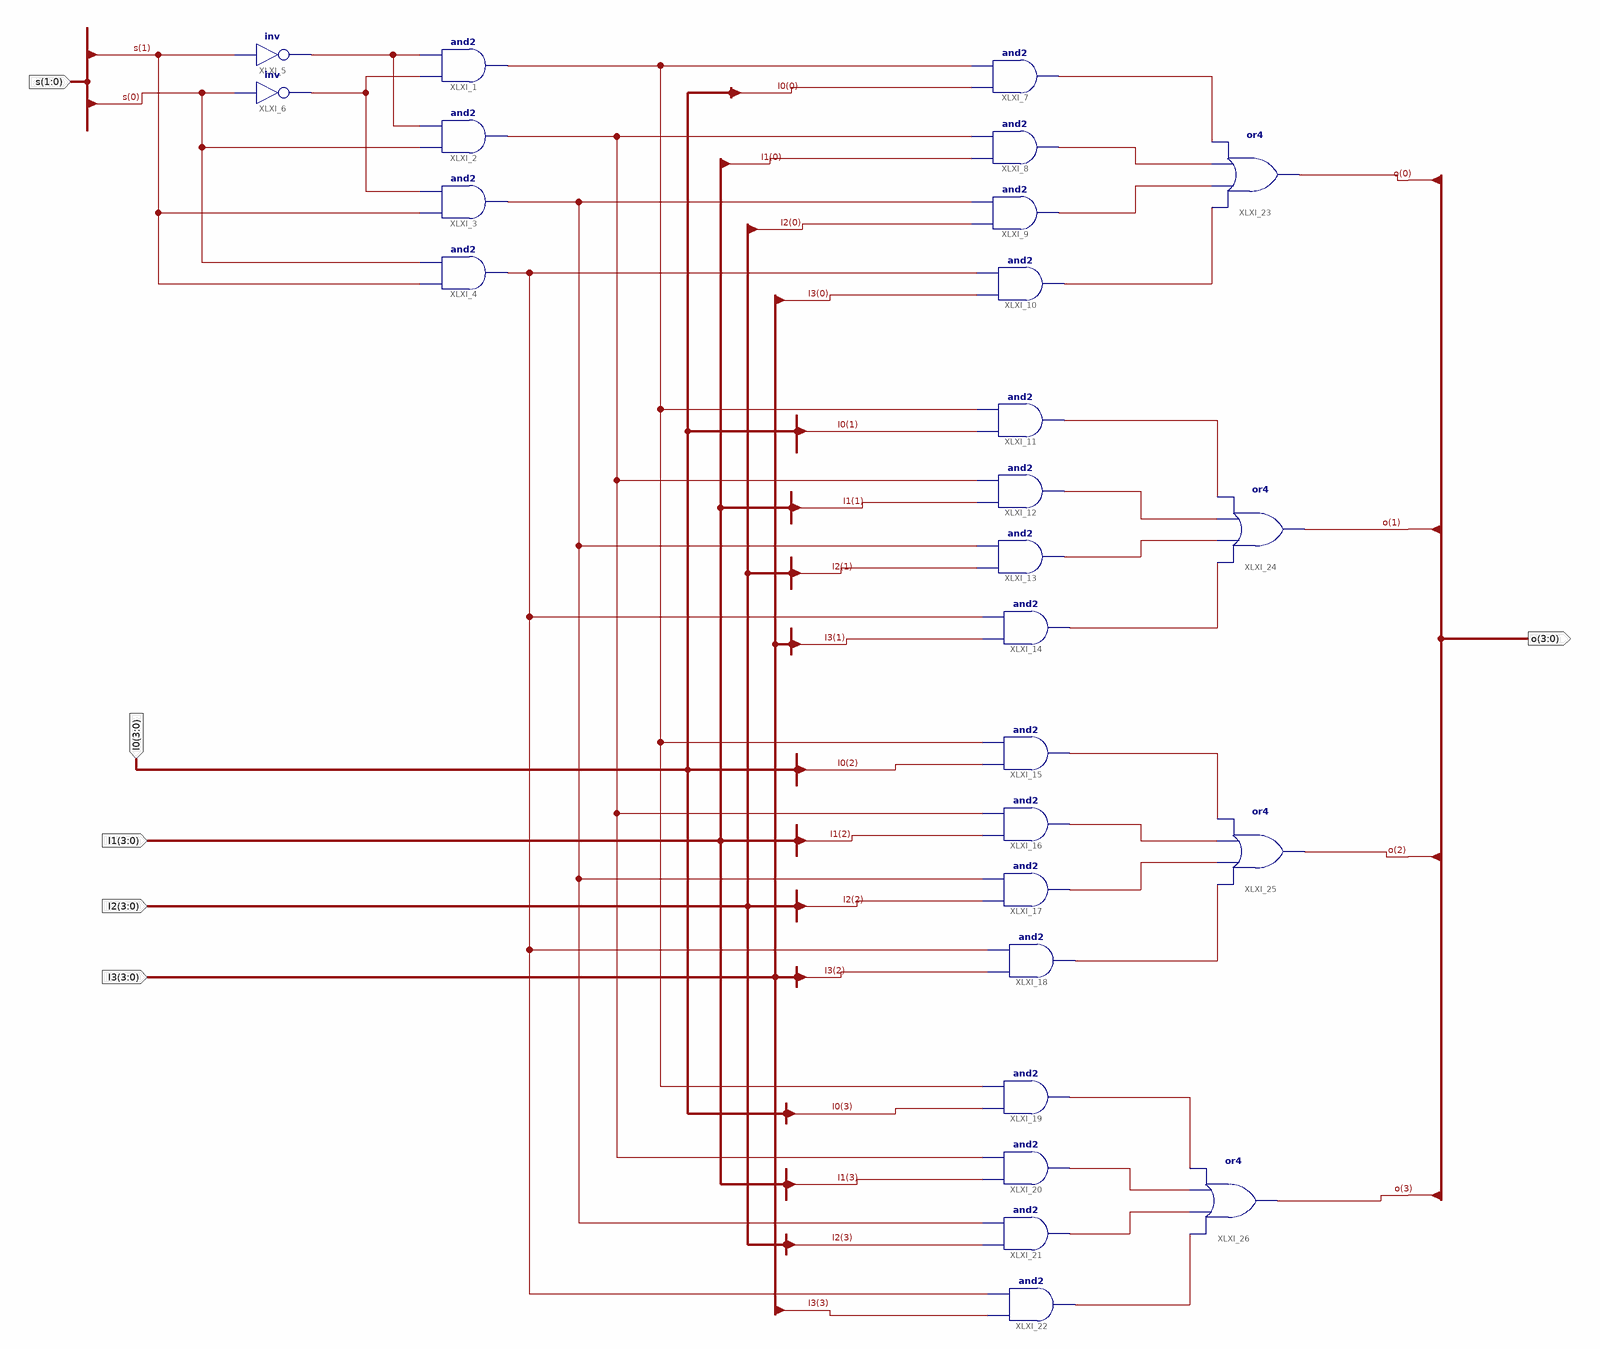
[diagram p0: schematic sheet 1]
// Xilinx ISE schematic Mux4to14b.sch (kintex7) as structural Verilog: 26 symbols, 6 ports
module Mux4to14b (
  input  [1:0] s,
  input  [3:0] I0,
  input  [3:0] I2,
  input  [3:0] I3,
  input  [3:0] I1,
  output [3:0] o
);

  wire XLXN_8, XLXN_9, XLXN_21, XLXN_23, XLXN_24, XLXN_27, XLXN_32, XLXN_33, XLXN_34, XLXN_35, XLXN_37,
       XLXN_38, XLXN_39, XLXN_40, XLXN_41, XLXN_42, XLXN_43, XLXN_44, XLXN_45, XLXN_46, XLXN_47, XLXN_48;

  and XLXI_1 (XLXN_21, XLXN_9, XLXN_8);
  and XLXI_2 (XLXN_23, s[0], XLXN_8);
  and XLXI_3 (XLXN_24, s[1], XLXN_9);
  and XLXI_4 (XLXN_27, s[1], s[0]);
  not XLXI_5 (XLXN_8, s[1]);
  not XLXI_6 (XLXN_9, s[0]);
  and XLXI_7 (XLXN_32, I0[0], XLXN_21);
  and XLXI_8 (XLXN_33, I1[0], XLXN_23);
  and XLXI_9 (XLXN_34, I2[0], XLXN_24);
  and XLXI_10 (XLXN_35, I3[0], XLXN_27);
  and XLXI_11 (XLXN_37, I0[1], XLXN_21);
  and XLXI_12 (XLXN_38, I1[1], XLXN_23);
  and XLXI_13 (XLXN_39, I2[1], XLXN_24);
  and XLXI_14 (XLXN_40, I3[1], XLXN_27);
  and XLXI_15 (XLXN_41, I0[2], XLXN_21);
  and XLXI_16 (XLXN_42, I1[2], XLXN_23);
  and XLXI_17 (XLXN_43, I2[2], XLXN_24);
  and XLXI_18 (XLXN_44, I3[2], XLXN_27);
  and XLXI_19 (XLXN_45, I0[3], XLXN_21);
  and XLXI_20 (XLXN_46, I1[3], XLXN_23);
  and XLXI_21 (XLXN_47, I2[3], XLXN_24);
  and XLXI_22 (XLXN_48, I3[3], XLXN_27);
  or XLXI_23 (o[0], XLXN_35, XLXN_34, XLXN_33, XLXN_32);
  or XLXI_24 (o[1], XLXN_40, XLXN_39, XLXN_38, XLXN_37);
  or XLXI_25 (o[2], XLXN_44, XLXN_43, XLXN_42, XLXN_41);
  or XLXI_26 (o[3], XLXN_48, XLXN_47, XLXN_46, XLXN_45);
endmodule
